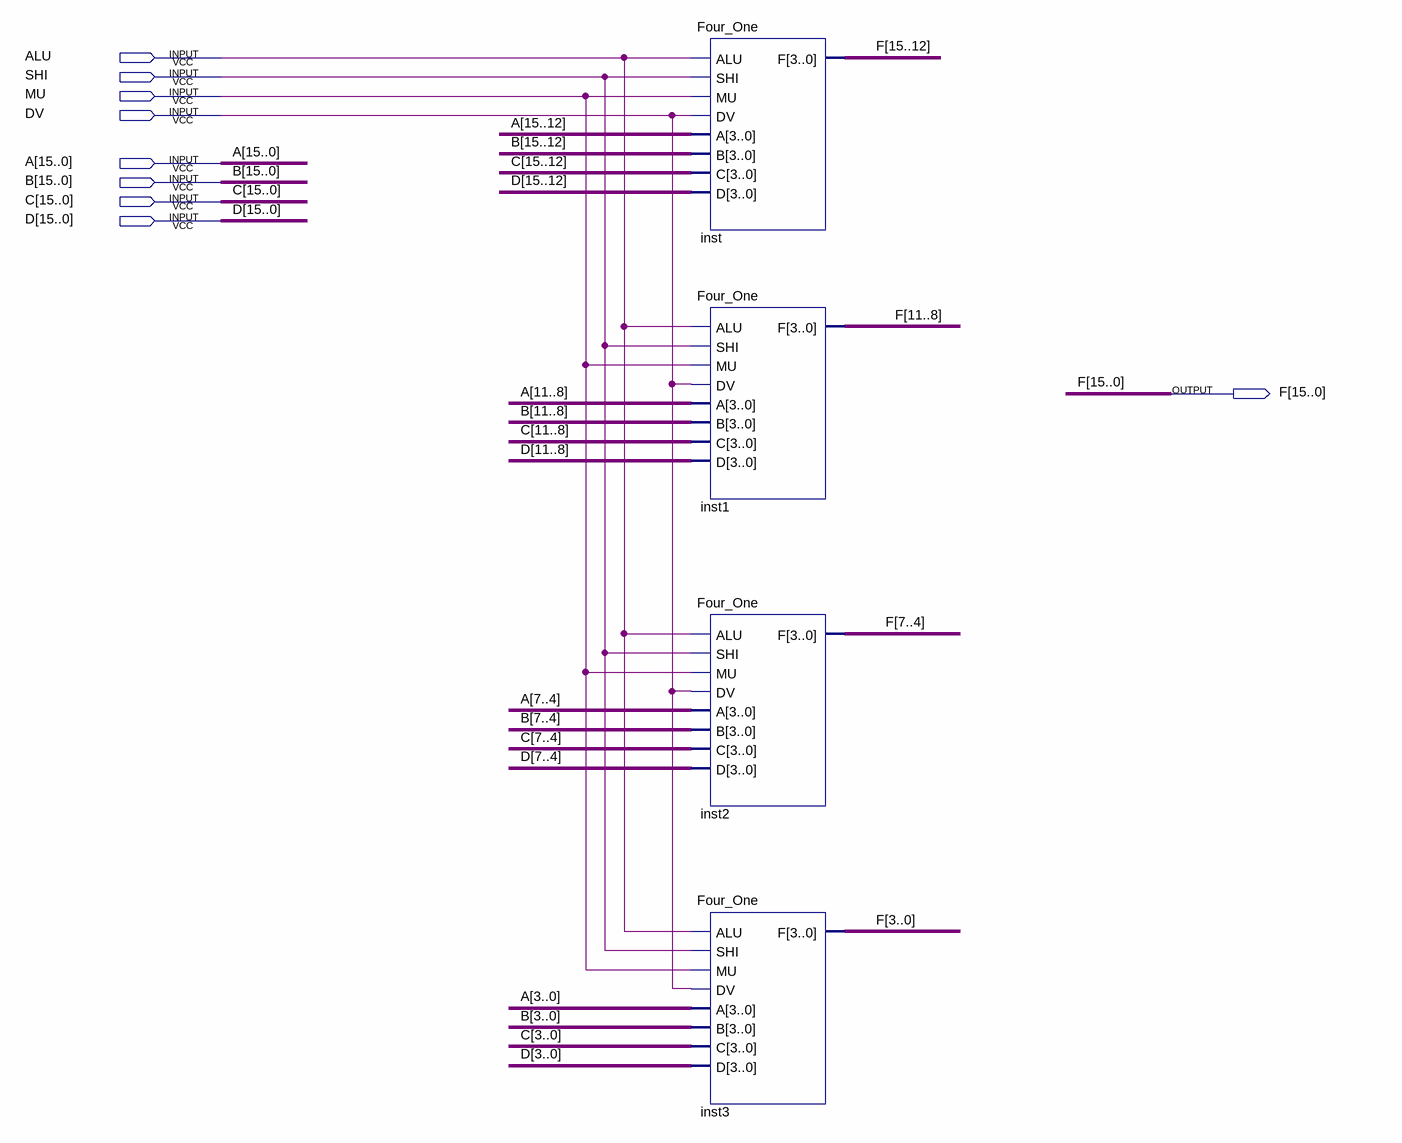
[diagram p0: schematic sheet]
// Quartus schematic Four_One_16Bit.bdf as structural Verilog: 4 symbols, 9 pins
module Four_One_16Bit (
  input  ALU,
  input  SHI,
  input  MU,
  input  DV,
  input  [15:0] A,
  input  [15:0] B,
  input  [15:0] C,
  input  [15:0] D,
  output [15:0] F
);

  Four_One inst (
    .ALU(ALU), .SHI(SHI), .MU(MU), .DV(DV), .A(A[15:12]), .B(B[15:12]), .C(C[15:12]), .D(D[15:12]),
    .F(F[15:12]));
  Four_One inst1 (
    .ALU(ALU), .SHI(SHI), .MU(MU), .DV(DV), .A(A[11:8]), .B(B[11:8]), .C(C[11:8]), .D(D[11:8]), .F(F[11:8]));
  Four_One inst2 (.ALU(ALU), .SHI(SHI), .MU(MU), .DV(DV), .A(A[7:4]), .B(B[7:4]), .C(C[7:4]), .D(D[7:4]), .F(F[7:4]));
  Four_One inst3 (.ALU(ALU), .SHI(SHI), .MU(MU), .DV(DV), .A(A[3:0]), .B(B[3:0]), .C(C[3:0]), .D(D[3:0]), .F(F[3:0]));
endmodule
